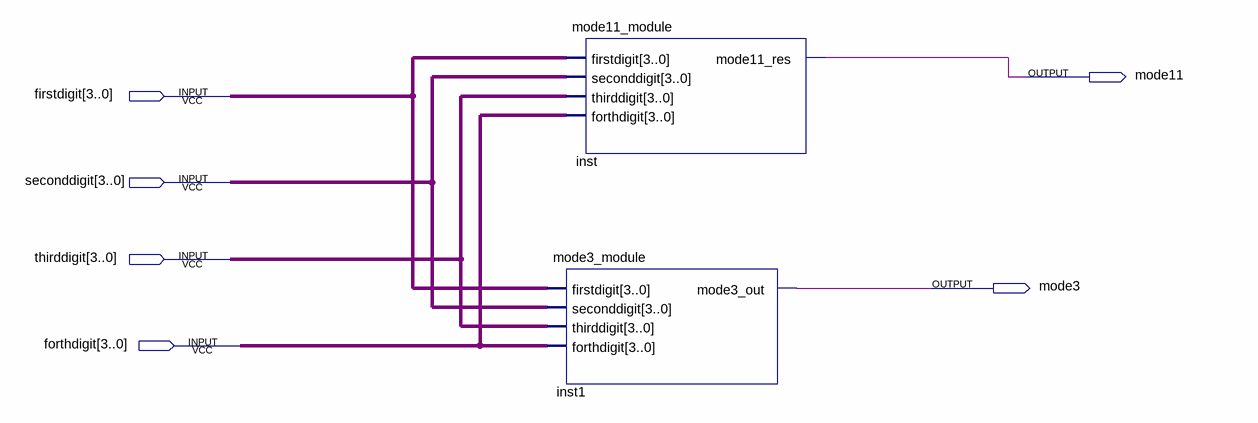
[diagram p0: schematic sheet]
// Quartus schematic mode.bdf as structural Verilog: 2 symbols, 6 pins
module mode (
  input  [3:0] firstdigit,
  input  [3:0] seconddigit,
  input  [3:0] thirddigit,
  input  [3:0] forthdigit,
  output mode11,
  output mode3
);

  mode3_module inst1 (
    .firstdigit(firstdigit), .seconddigit(seconddigit), .thirddigit(thirddigit), .forthdigit(forthdigit),
    .mode3_out(mode3));
  mode11_module inst (
    .firstdigit(firstdigit), .seconddigit(seconddigit), .thirddigit(thirddigit), .forthdigit(forthdigit),
    .mode11_res(mode11));
endmodule
